# EAGLE schematic main_xml (EAGLE 7.7.0)

## Sheet 1 of 4
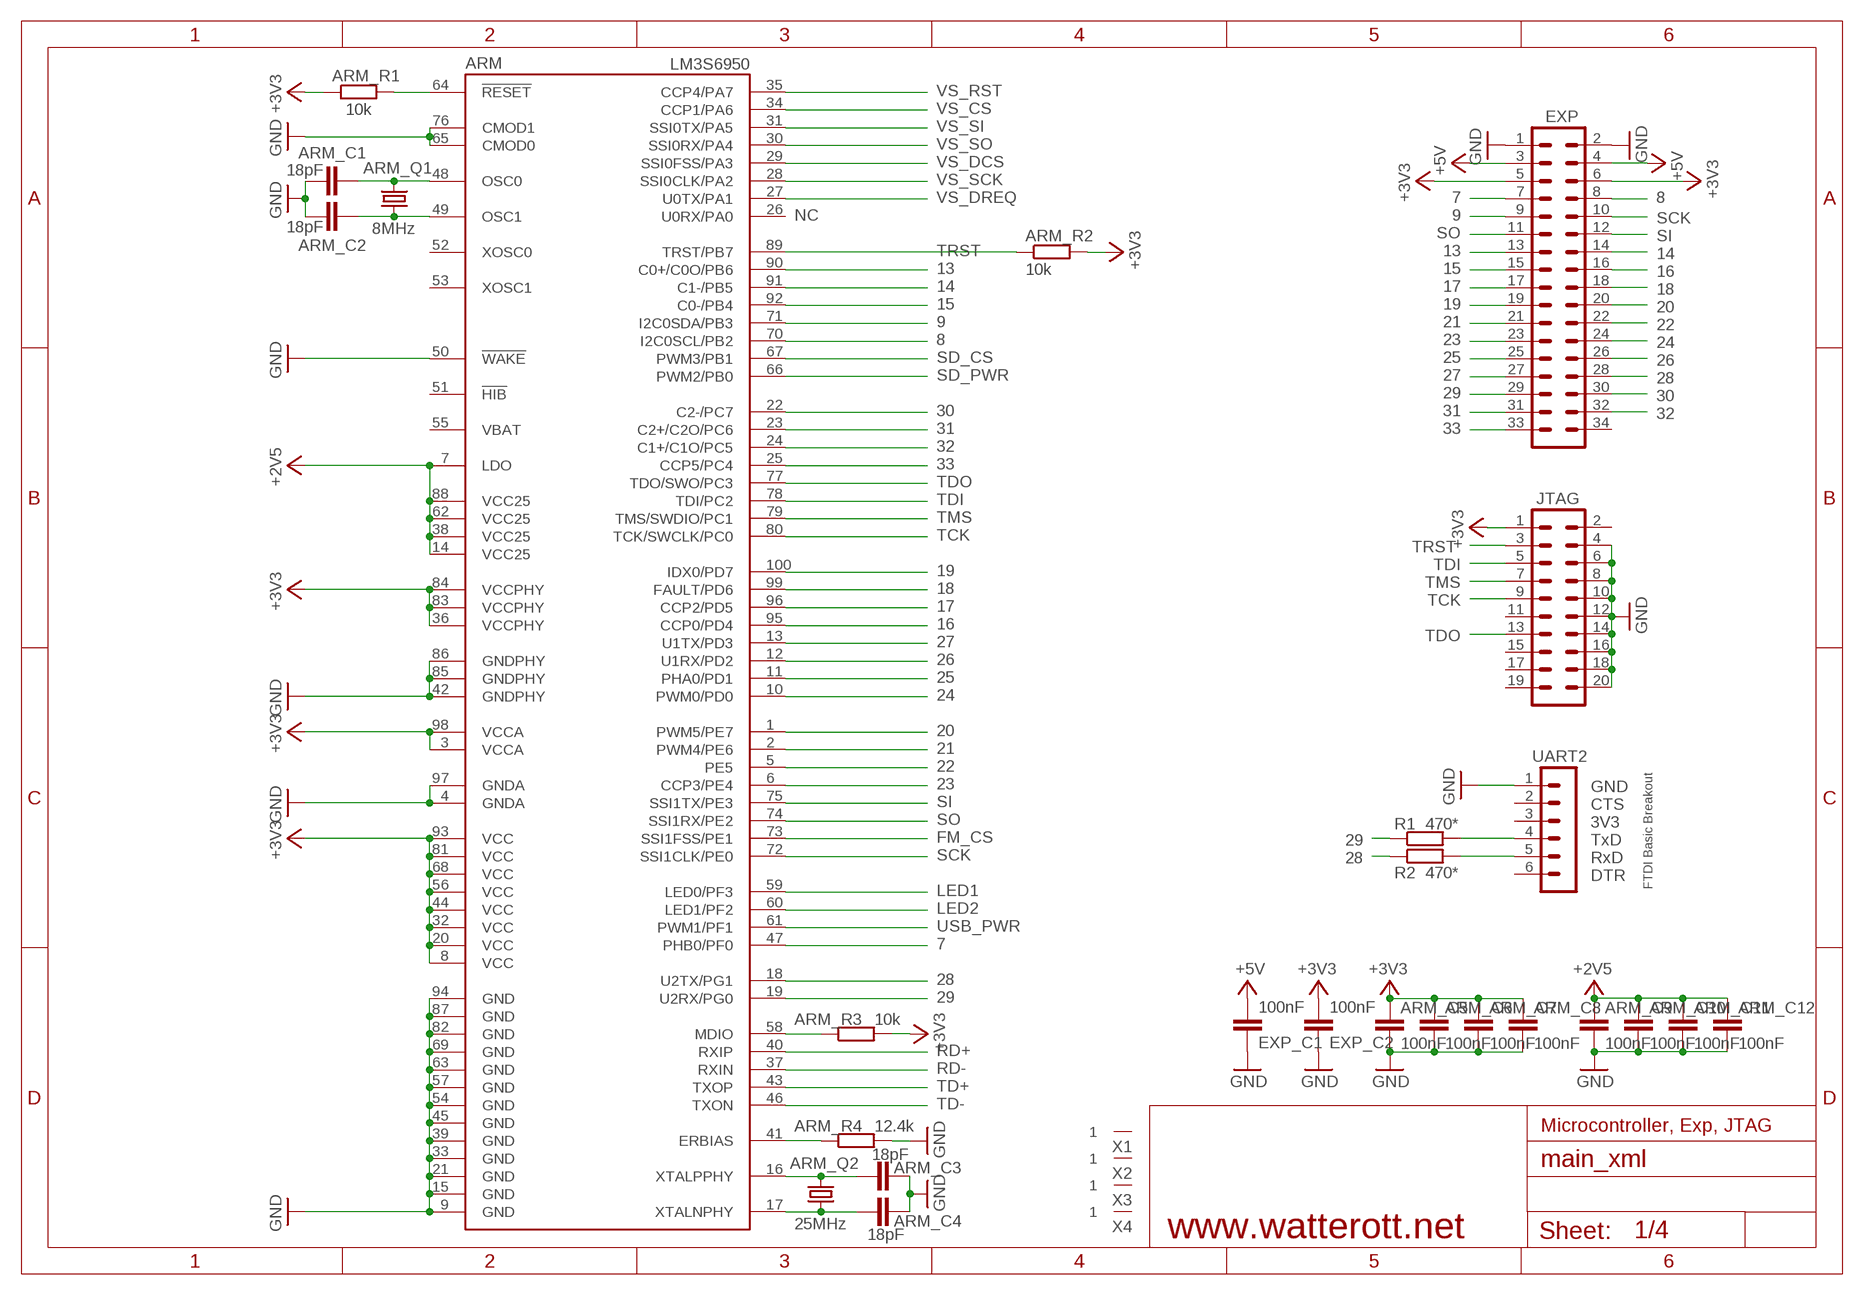
[diagram p0: schematic, sheet 1]

### Parts
ARM  LM3S6950  [LQFP100]
ARM_C1  18pF  C-EUC0603  [C0603]
ARM_C2  18pF  C-EUC0603  [C0603]
ARM_C3  18pF  C-EUC0603  [C0603]
ARM_C4  18pF  C-EUC0603  [C0603]
ARM_C5  100nF  C-EUC0603  [C0603]
ARM_C6  100nF  C-EUC0603  [C0603]
ARM_C7  100nF  C-EUC0603  [C0603]
ARM_C8  100nF  C-EUC0603  [C0603]
ARM_C9  100nF  C-EUC0603  [C0603]
ARM_C10  100nF  C-EUC0603  [C0603]
ARM_C11  100nF  C-EUC0603  [C0603]
ARM_C12  100nF  C-EUC0603  [C0603]
ARM_Q1  8MHz  CRYSTALCS10  [CS10]
ARM_Q2  25MHz  CRYSTALCS10  [CS10]
ARM_R1  10k  R-EU_R0603  [R0603]
ARM_R2  10k  R-EU_R0603  [R0603]
ARM_R3  10k  R-EU_R0603  [R0603]
ARM_R4  12.4k  R-EU_R0603  [R0603]
EXP  MA17-2  [MA17-2]
EXP_C1  100nF  C-EUC0603  [C0603]
EXP_C2  100nF  C-EUC0603  [C0603]
JTAG  MA10-2SMD  [MA10-2_SMD]
R1  470*  R-EU_R0603  [R0603]
R2  470*  R-EU_R0603  [R0603]
UART2  MA06-1  [MA06-1]
X1  ELLIPTICAL-PADS  [SMD-ELLIPSE]
X2  ELLIPTICAL-PADS  [SMD-ELLIPSE]
X3  ELLIPTICAL-PADS  [SMD-ELLIPSE]
X4  ELLIPTICAL-PADS  [SMD-ELLIPSE]

### Nets
7: ARM.47(PHB0/PF0) EXP.7
8: ARM.70(I2C0SCL/PB2) EXP.8
9: ARM.71(I2C0SDA/PB3) EXP.9
13: ARM.90(C0+/C0O/PB6) EXP.13
14: ARM.91(C1-/PB5) EXP.14
15: ARM.92(C0-/PB4) EXP.15
16: ARM.95(CCP0/PD4) EXP.16
17: ARM.96(CCP2/PD5) EXP.17
18: ARM.99(FAULT/PD6) EXP.18
19: ARM.100(IDX0/PD7) EXP.19
20: ARM.1(PWM5/PE7) EXP.20
21: ARM.2(PWM4/PE6) EXP.21
22: ARM.5(PE5) EXP.22
23: ARM.6(CCP3/PE4) EXP.23
24: ARM.10(PWM0/PD0) EXP.24
25: ARM.11(PHA0/PD1) EXP.25
26: ARM.12(U1RX/PD2) EXP.26
27: ARM.13(U1TX/PD3) EXP.27
28: ARM.18(U2TX/PG1) EXP.28 R2.1
29: ARM.19(U2RX/PG0) EXP.29 R1.1
30: ARM.22(C2-/PC7) EXP.30
31: ARM.23(C2+/C2O/PC6) EXP.31
32: ARM.24(C1+/C1O/PC5) EXP.32
33: ARM.25(CCP5/PC4) EXP.33
+2V5: ARM.7(LDO) ARM.14(VCC25) ARM.38(VCC25) ARM.62(VCC25) ARM.88(VCC25) ARM_C9.1 ARM_C10.1 ARM_C11.1 ARM_C12.1
+3V3: ARM.3(VCCA) ARM.8(VCC) ARM.20(VCC) ARM.32(VCC) ARM.36(VCCPHY) ARM.44(VCC) ARM.56(VCC) ARM.68(VCC) ARM.81(VCC) ARM.83(VCCPHY) ARM.84(VCCPHY) ARM.93(VCC) ARM.98(VCCA) ARM_C5.1 ARM_C6.1 ARM_C7.1 ARM_C8.1 ARM_R1.1 ARM_R2.2 ARM_R3.2 EXP.5 EXP.6 EXP_C2.2 JTAG.1 ; also sheet 2,3,4
+5V: EXP.3 EXP.4 EXP_C1.2 ; also sheet 3,4
ERBIAS: ARM.41(ERBIAS) ARM_R4.1
FM_CS: ARM.73(SSI1FSS/PE1) ; also sheet 2
GND: ARM.4(GNDA) ARM.9(GND) ARM.15(GND) ARM.21(GND) ARM.33(GND) ARM.39(GND) ARM.42(GNDPHY) ARM.45(GND) ARM.50(!WAKE) ARM.54(GND) ARM.57(GND) ARM.63(GND) ARM.65(CMOD0) ARM.69(GND) ARM.76(CMOD1) ARM.82(GND) ARM.85(GNDPHY) ARM.86(GNDPHY) ARM.87(GND) ARM.94(GND) ARM.97(GNDA) ARM_C1.2 ARM_C2.2 ARM_C3.2 ARM_C4.2 ARM_C5.2 ARM_C6.2 ARM_C7.2 ARM_C8.2 ARM_C9.2 ARM_C10.2 ARM_C11.2 ARM_C12.2 ARM_R4.2 EXP.1 EXP.2 EXP_C1.1 EXP_C2.1 JTAG.4 JTAG.6 JTAG.8 JTAG.10 JTAG.12 JTAG.14 JTAG.16 JTAG.18 JTAG.20 UART2.1 ; also sheet 2,3,4
LED1: ARM.59(LED0/PF3) ; also sheet 2
LED2: ARM.60(LED1/PF2) ; also sheet 2
MDIO: ARM.58(MDIO) ARM_R3.1
N$9: ARM.48(OSC0) ARM_C1.1 ARM_Q1.2
N$10: ARM.49(OSC1) ARM_C2.1 ARM_Q1.1
N$13: ARM.17(XTALNPHY) ARM_C4.1 ARM_Q2.1
N$14: ARM.16(XTALPPHY) ARM_C3.1 ARM_Q2.2
RD+: ARM.40(RXIP) ; also sheet 2
RD-: ARM.37(RXIN) ; also sheet 2
RESET: ARM.64(!RESET) ARM_R1.2
RXD: R2.2 UART2.5
SCK: ARM.72(SSI1CLK/PE0) EXP.10 ; also sheet 2
SD_CS: ARM.67(PWM3/PB1) ; also sheet 2
SD_PWR: ARM.66(PWM2/PB0) ; also sheet 2
SI: ARM.75(SSI1TX/PE3) EXP.12 ; also sheet 2
SO: ARM.74(SSI1RX/PE2) EXP.11 ; also sheet 2
TCK: ARM.80(TCK/SWCLK/PC0) JTAG.9
TD+: ARM.43(TXOP) ; also sheet 2
TD-: ARM.46(TXON) ; also sheet 2
TDI: ARM.78(TDI/PC2) JTAG.5
TDO: ARM.77(TDO/SWO/PC3) JTAG.13
TMS: ARM.79(TMS/SWDIO/PC1) JTAG.7
TRST: ARM.89(TRST/PB7) ARM_R2.1 JTAG.3
TXD: R1.2 UART2.4
USB_PWR: ARM.61(PWM1/PF1) ; also sheet 4
VS_CS: ARM.34(CCP1/PA6) ; also sheet 3
VS_DCS: ARM.29(SSI0FSS/PA3) ; also sheet 3
VS_DREQ: ARM.27(U0TX/PA1) ; also sheet 3
VS_RST: ARM.35(CCP4/PA7) ; also sheet 3
VS_SCK: ARM.28(SSI0CLK/PA2) ; also sheet 3
VS_SI: ARM.31(SSI0TX/PA5) ; also sheet 3
VS_SO: ARM.30(SSI0RX/PA4) ; also sheet 3
Unconnected: ARM.26(U0RX/PA0) ARM.51(!HIB) ARM.52(XOSC0) ARM.53(XOSC1) EXP.34 JTAG.2 JTAG.11 JTAG.15 JTAG.17 JTAG.19 UART2.2 UART2.3 UART2.6 X1.1 X2.1 X3.1 X4.1

### Notes on the sheet
- NC
- GND
- CTS
- 3V3
- TxD
- RxD
- DTR
- FTDI Basic Breakout
- Microcontroller, Exp, JTAG
- www.watterott.net

## Sheet 2 of 4
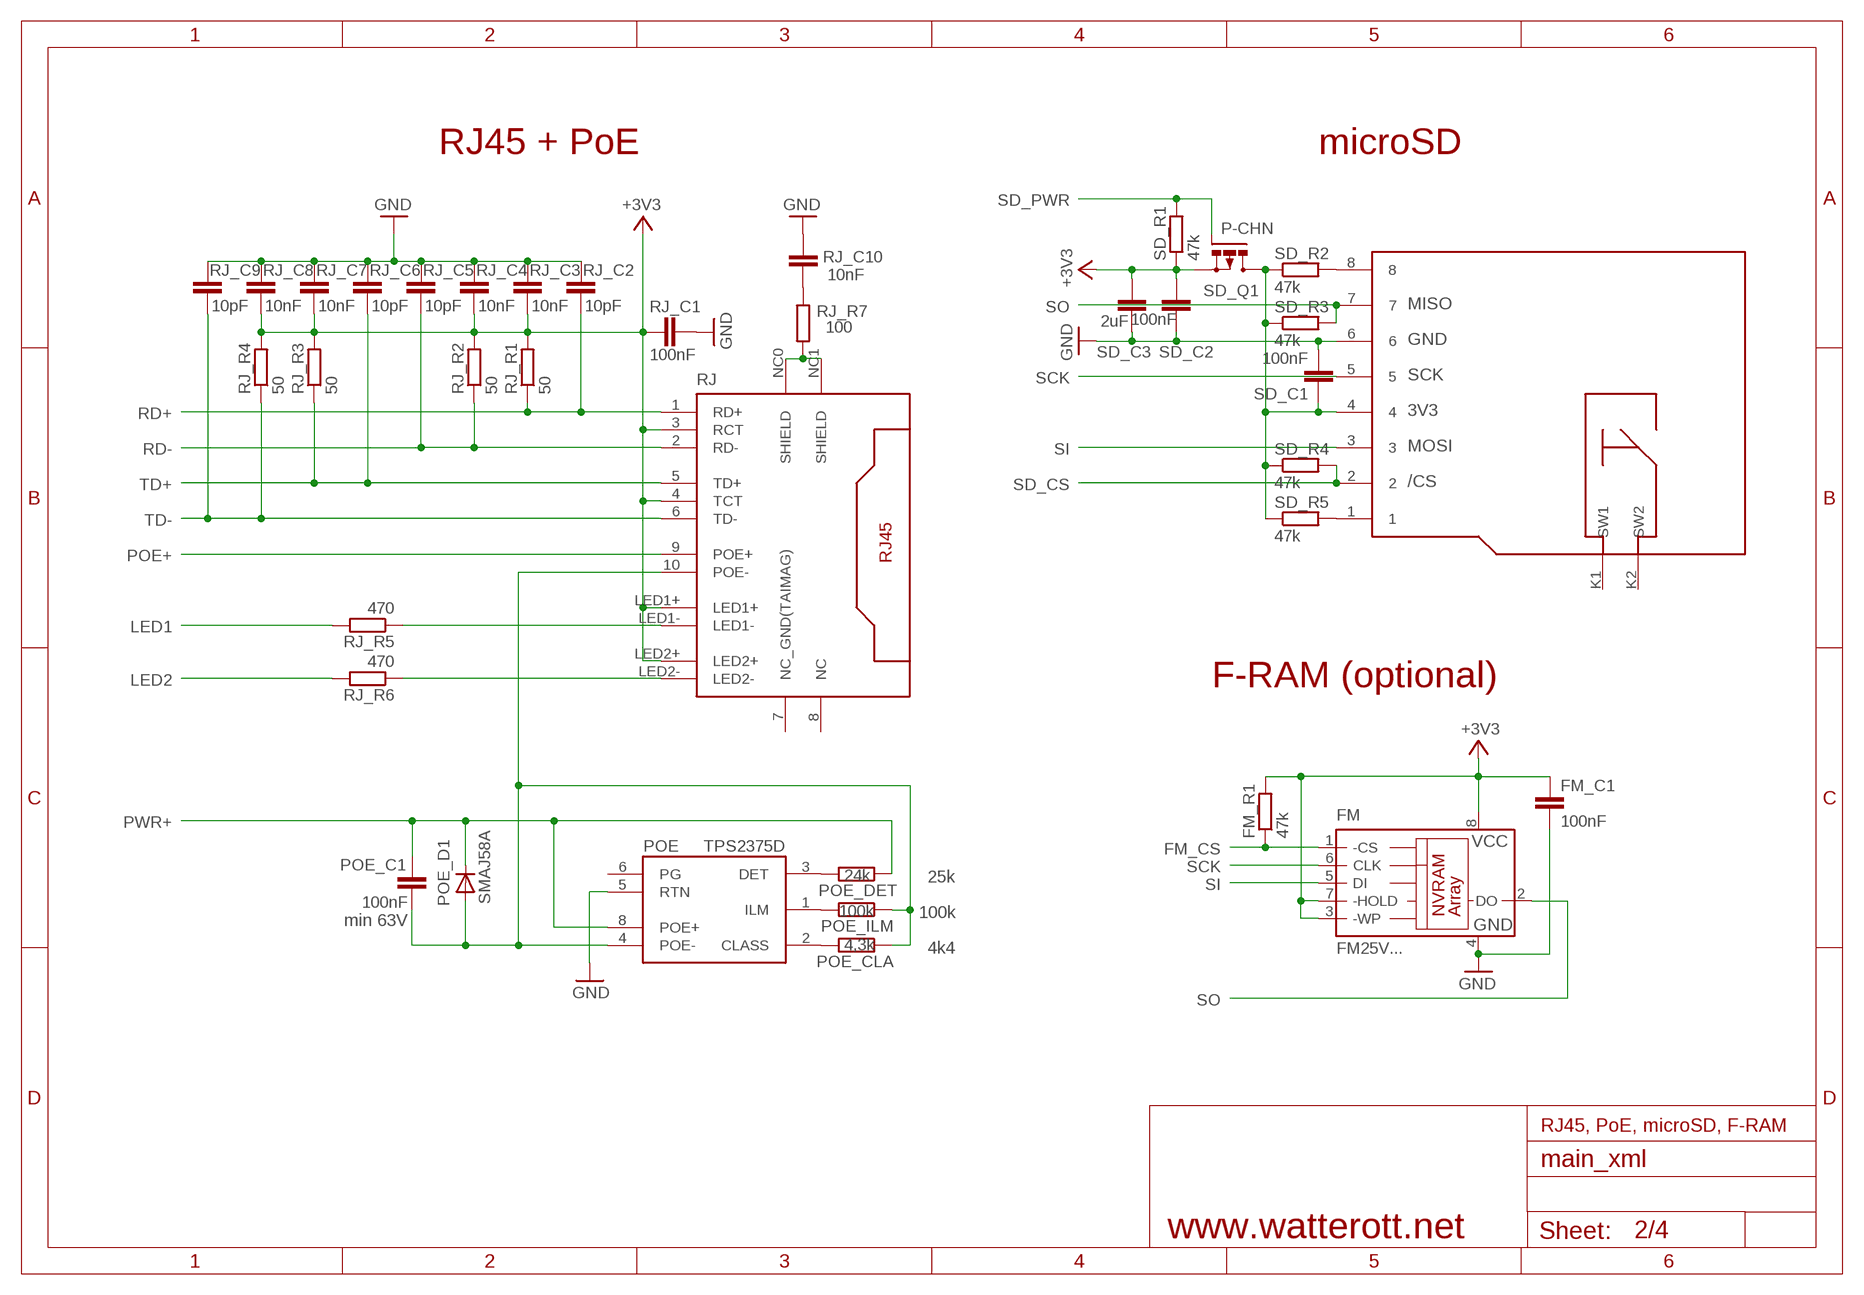
[diagram p1: schematic, sheet 2]

### Parts
FM  FM25V...  FM25-S  [SO8]
FM_C1  100nF  C-EUC0603  [C0603]
FM_R1  47k  R-EU_R0603  [R0603]
POE  TPS2375D  TPS237X  [SO08]
POE_C1  100nF  C-EUC1206  [C1206]
POE_CLA  4,3k  R-EU_R0603  [R0603]
POE_D1  SMAJ58A  DIODE-DO214AA  [DO214AA]
POE_DET  24k  R-EU_R0603  [R0603]
POE_ILM  100k  R-EU_R0603  [R0603]
RJ  RJ45-8-POEWE  [WE_POE]
RJ_C1  100nF  C-EUC0603  [C0603]
RJ_C2  10pF  C-EUC0603  [C0603]
RJ_C3  10nF  C-EUC0603  [C0603]
RJ_C4  10nF  C-EUC0603  [C0603]
RJ_C5  10pF  C-EUC0603  [C0603]
RJ_C6  10pF  C-EUC0603  [C0603]
RJ_C7  10nF  C-EUC0603  [C0603]
RJ_C8  10nF  C-EUC0603  [C0603]
RJ_C9  10pF  C-EUC0603  [C0603]
RJ_C10  10nF  C-EUC0603  [C0603]
RJ_R1  50  R-EU_R0603  [R0603]
RJ_R2  50  R-EU_R0603  [R0603]
RJ_R3  50  R-EU_R0603  [R0603]
RJ_R4  50  R-EU_R0603  [R0603]
RJ_R5  470  R-EU_R0603  [R0603]
RJ_R6  470  R-EU_R0603  [R0603]
RJ_R7  100  R-EU_R0603  [R0603]
SD  MICRO-SD  [MICRO-SD]
SD_C1  100nF  C-EUC0603  [C0603]
SD_C2  100nF  C-EUC0603  [C0603]
SD_C3  2uF  C-EUC0603  [C0603]
SD_Q1  P-CHN  IRLML6402  [MICRO3]
SD_R1  47k  R-EU_R0603  [R0603]
SD_R2  47k  R-EU_R0603  [R0603]
SD_R3  47k  R-EU_R0603  [R0603]
SD_R4  47k  R-EU_R0603  [R0603]
SD_R5  47k  R-EU_R0603  [R0603]

### Nets
+3V3: FM.3(-WP) FM.7(-HOLD) FM.8(VCC) FM_C1.1 FM_R1.2 RJ.3(RCT) RJ.4(TCT) RJ.LED1+ RJ.LED2+ RJ_C1.1 RJ_C3.2 RJ_C4.2 RJ_C7.2 RJ_C8.2 RJ_R1.2 RJ_R2.2 RJ_R3.2 RJ_R4.2 SD_C2.2 SD_C3.2 SD_Q1.2(S) SD_R1.1 ; also sheet 1,3,4
CLASS: POE.2(CLASS) POE_CLA.2
DET: POE.3(DET) POE_DET.2
FM_CS: FM.1(-CS) FM_R1.1 ; also sheet 1
GND: FM.4(GND) FM_C1.2 POE.5(RTN) RJ_C1.2 RJ_C2.1 RJ_C3.1 RJ_C4.1 RJ_C5.1 RJ_C6.1 RJ_C7.1 RJ_C8.1 RJ_C9.1 RJ_C10.2 SD.6 SD_C1.2 SD_C2.1 SD_C3.1 ; also sheet 1,3,4
ILM: POE.1(ILM) POE_ILM.2
LED1: RJ_R5.2 ; also sheet 1
LED2: RJ_R6.2 ; also sheet 1
N$4: RJ.LED2- RJ_R6.1
N$5: RJ.LED1- RJ_R5.1
N$29: RJ_C10.1 RJ_R7.1
POE+: RJ.9(POE+) ; also sheet 4
POE-: POE.4(POE-) POE_C1.2 POE_CLA.1 POE_D1.A POE_ILM.1 RJ.10(POE-)
PWR+: POE.8(POE+) POE_C1.1 POE_D1.C POE_DET.1 ; also sheet 4
RD+: RJ.1(RD+) RJ_C2.2 RJ_R1.1 ; also sheet 1
RD-: RJ.2(RD-) RJ_C5.2 RJ_R2.1 ; also sheet 1
SCK: FM.6(CLK) SD.5 ; also sheet 1
SD_1: SD.1 SD_R5.2
SD_3V3: SD.4 SD_C1.1 SD_Q1.3(D) SD_R2.1 SD_R3.1 SD_R4.1 SD_R5.1
SD_8: SD.8 SD_R2.2
SD_CS: SD.2 SD_R4.2 ; also sheet 1
SD_PWR: SD_Q1.1(G) SD_R1.2 ; also sheet 1
SHIELD: RJ.NC0(SHIELD) RJ.NC1(SHIELD) RJ_R7.2
SI: FM.5(DI) SD.3 ; also sheet 1
SO: FM.2(DO) SD.7 SD_R3.2 ; also sheet 1
TD+: RJ.5(TD+) RJ_C6.2 RJ_R3.1 ; also sheet 1
TD-: RJ.6(TD-) RJ_C9.2 RJ_R4.1 ; also sheet 1
Unconnected: POE.6(PG) SD.K1(SW1) SD.K2(SW2)

### Notes on the sheet
- RJ45 + PoE | microSD
- F-RAM (optional)
- 25k
- 100k
- 4k4
- RJ45, PoE, microSD, F-RAM
- www.watterott.net

## Sheet 3 of 4
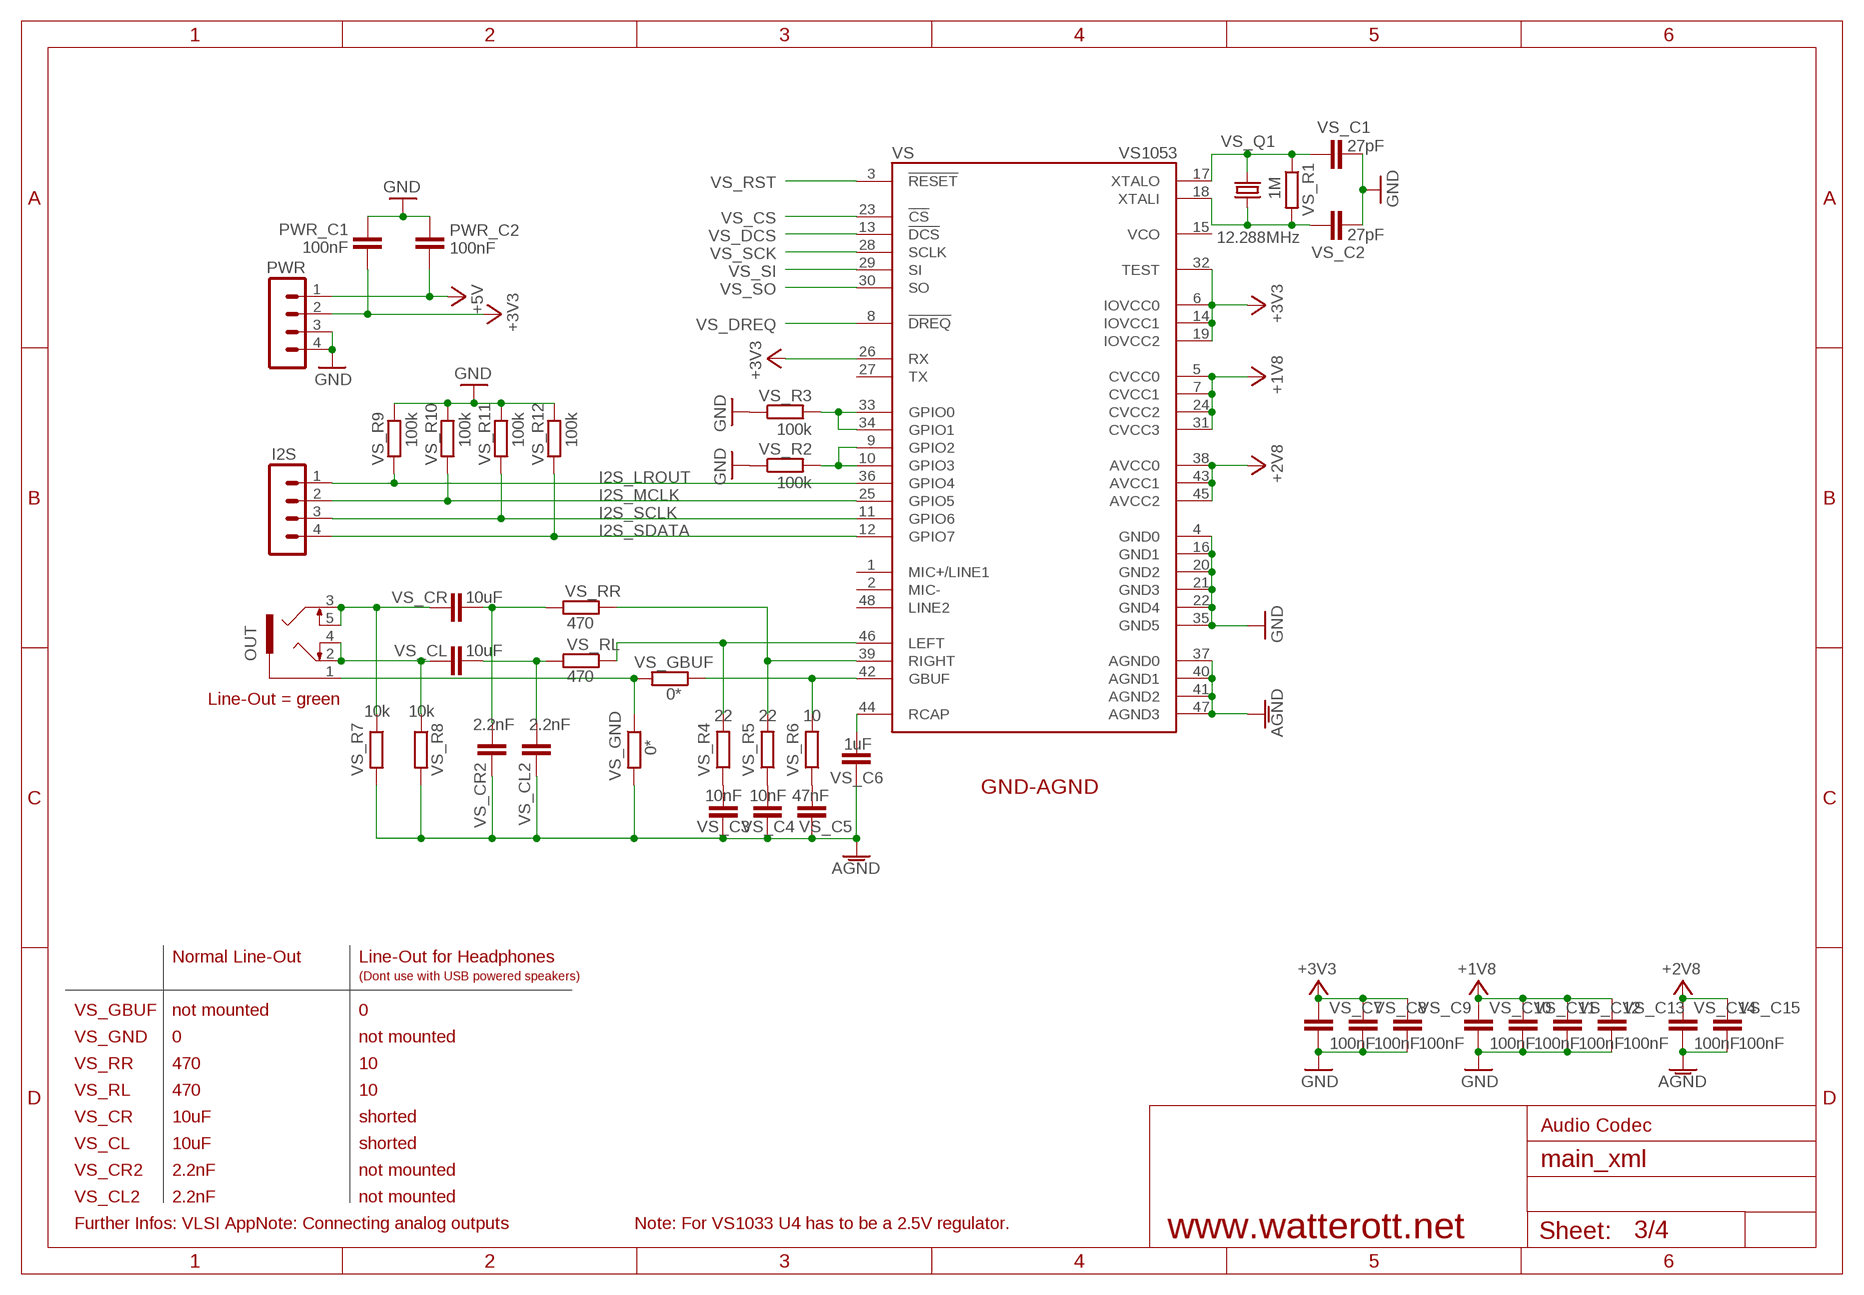
[diagram p2: schematic, sheet 3]

### Parts
I2S  MA04-1  [MA04-1]
OUT  1503_09  [1503_09]
PWR  MA04-1  [MA04-1]
PWR_C1  100nF  C-EUC0603  [C0603]
PWR_C2  100nF  C-EUC0603  [C0603]
VS  VS1053  [LQFP-48]
VS_C1  27pF  C-EUC0603  [C0603]
VS_C2  27pF  C-EUC0603  [C0603]
VS_C3  10nF  C-EUC0603  [C0603]
VS_C4  10nF  C-EUC0603  [C0603]
VS_C5  47nF  C-EUC0603  [C0603]
VS_C6  1uF  C-EUC0603  [C0603]
VS_C7  100nF  C-EUC0603  [C0603]
VS_C8  100nF  C-EUC0603  [C0603]
VS_C9  100nF  C-EUC0603  [C0603]
VS_C10  100nF  C-EUC0603  [C0603]
VS_C11  100nF  C-EUC0603  [C0603]
VS_C12  100nF  C-EUC0603  [C0603]
VS_C13  100nF  C-EUC0603  [C0603]
VS_C14  100nF  C-EUC0603  [C0603]
VS_C15  100nF  C-EUC0603  [C0603]
VS_CL  10uF  C-EUC1210  [C1210]
VS_CL2  2.2nF  C-EUC0603  [C0603]
VS_CR  10uF  C-EUC1210  [C1210]
VS_CR2  2.2nF  C-EUC0603  [C0603]
VS_GBUF  0*  R-EU_R0603  [R0603]
VS_GND  0*  R-EU_R0603  [R0603]
VS_Q1  12.288MHz  CRYSTALSM49  [SM49]
VS_R1  1M  R-EU_R0603  [R0603]
VS_R2  100k  R-EU_R0603  [R0603]
VS_R3  100k  R-EU_R0603  [R0603]
VS_R4  22  R-EU_R0603  [R0603]
VS_R5  22  R-EU_R0603  [R0603]
VS_R6  10  R-EU_R0603  [R0603]
VS_R7  10k  R-EU_R0603  [R0603]
VS_R8  10k  R-EU_R0603  [R0603]
VS_R9  100k  R-EU_R0603  [R0603]
VS_R10  100k  R-EU_R0603  [R0603]
VS_R11  100k  R-EU_R0603  [R0603]
VS_R12  100k  R-EU_R0603  [R0603]
VS_RL  470  R-EU_R0603  [R0603]
VS_RR  470  R-EU_R0603  [R0603]

### Nets
+1V8: VS.5(CVCC0) VS.7(CVCC1) VS.24(CVCC2) VS.31(CVCC3) VS_C10.1 VS_C11.1 VS_C12.1 VS_C13.1 ; also sheet 4
+2V8: VS.38(AVCC0) VS.43(AVCC1) VS.45(AVCC2) VS_C14.1 VS_C15.1 ; also sheet 4
+3V3: PWR.2 PWR_C1.2 VS.6(IOVCC0) VS.14(IOVCC1) VS.19(IOVCC2) VS.26(RX) VS.32(TEST) VS_C7.1 VS_C8.1 VS_C9.1 ; also sheet 1,2,4
+5V: PWR.1 PWR_C2.2 ; also sheet 1,4
AGND: VS.37(AGND0) VS.40(AGND1) VS.41(AGND2) VS.47(AGND3) VS_C3.1 VS_C4.1 VS_C5.1 VS_C6.1 VS_C14.2 VS_C15.2 VS_CL2.2 VS_CR2.2 VS_GND.2 VS_R7.2 VS_R8.2 ; also sheet 4
GBUF: VS.42(GBUF) VS_GBUF.1 VS_R6.2
GND: PWR.3 PWR.4 PWR_C1.1 PWR_C2.1 VS.4(GND0) VS.16(GND1) VS.20(GND2) VS.21(GND3) VS.22(GND4) VS.35(GND5) VS_C1.2 VS_C2.2 VS_C7.2 VS_C8.2 VS_C9.2 VS_C10.2 VS_C11.2 VS_C12.2 VS_C13.2 VS_R2.1 VS_R3.1 VS_R9.2 VS_R10.2 VS_R11.2 VS_R12.2 ; also sheet 1,2,4
I2S_LROUT: I2S.1 VS.36(GPIO4) VS_R9.1
I2S_MCLK: I2S.2 VS.25(GPIO5) VS_R10.1
I2S_SCLK: I2S.3 VS.11(GPIO6) VS_R11.1
I2S_SDATA: I2S.4 VS.12(GPIO7) VS_R12.1
LEFT: VS.46(LEFT) VS_R4.2 VS_RL.1
N$3: VS.33(GPIO0) VS.34(GPIO1) VS_R3.2
N$6: VS.9(GPIO2) VS.10(GPIO3) VS_R2.2
N$8: VS.18(XTALI) VS_C2.1 VS_Q1.1 VS_R1.2
N$11: VS.17(XTALO) VS_C1.1 VS_Q1.2 VS_R1.1
N$18: OUT.1 VS_GBUF.2 VS_GND.1
N$19: OUT.3 OUT.5 VS_CR.2 VS_R7.1
N$20: OUT.2 OUT.4 VS_CL.2 VS_R8.1
N$21: VS_CR2.1 VS_CR.1 VS_RR.2
N$22: VS_CL2.1 VS_CL.1 VS_RL.2
N$31: VS_C3.2 VS_R4.1
N$32: VS_C4.2 VS_R5.1
N$33: VS_C5.2 VS_R6.1
RCAP: VS.44(RCAP) VS_C6.2
RIGHT: VS.39(RIGHT) VS_R5.2 VS_RR.1
VS_CS: VS.23(!CS) ; also sheet 1
VS_DCS: VS.13(!DCS) ; also sheet 1
VS_DREQ: VS.8(!DREQ) ; also sheet 1
VS_RST: VS.3(!RESET) ; also sheet 1
VS_SCK: VS.28(SCLK) ; also sheet 1
VS_SI: VS.29(SI) ; also sheet 1
VS_SO: VS.30(SO) ; also sheet 1
Unconnected: VS.1(MIC+/LINE1) VS.2(MIC-) VS.15(VCO) VS.27(TX) VS.48(LINE2)

### Notes on the sheet
- Line-Out = green
- GND-AGND
- Normal Line-Out | Line-Out for Headphones
- (Dont use with USB powered speakers)
- VS_GBUF | not mounted | 0
- VS_GND | 0 | not mounted
- VS_RR | 470 | 10
- VS_RL | 470 | 10
- VS_CR | 10uF | shorted
- Audio Codec
- VS_CL | 10uF | shorted
- VS_CR2 | 2.2nF | not mounted
- VS_CL2 | 2.2nF | not mounted
- Further Infos: VLSI AppNote: Connecting analog outputs | Note: For VS1033 U4 has to be a 2.5V regulator.
- www.watterott.net

## Sheet 4 of 4
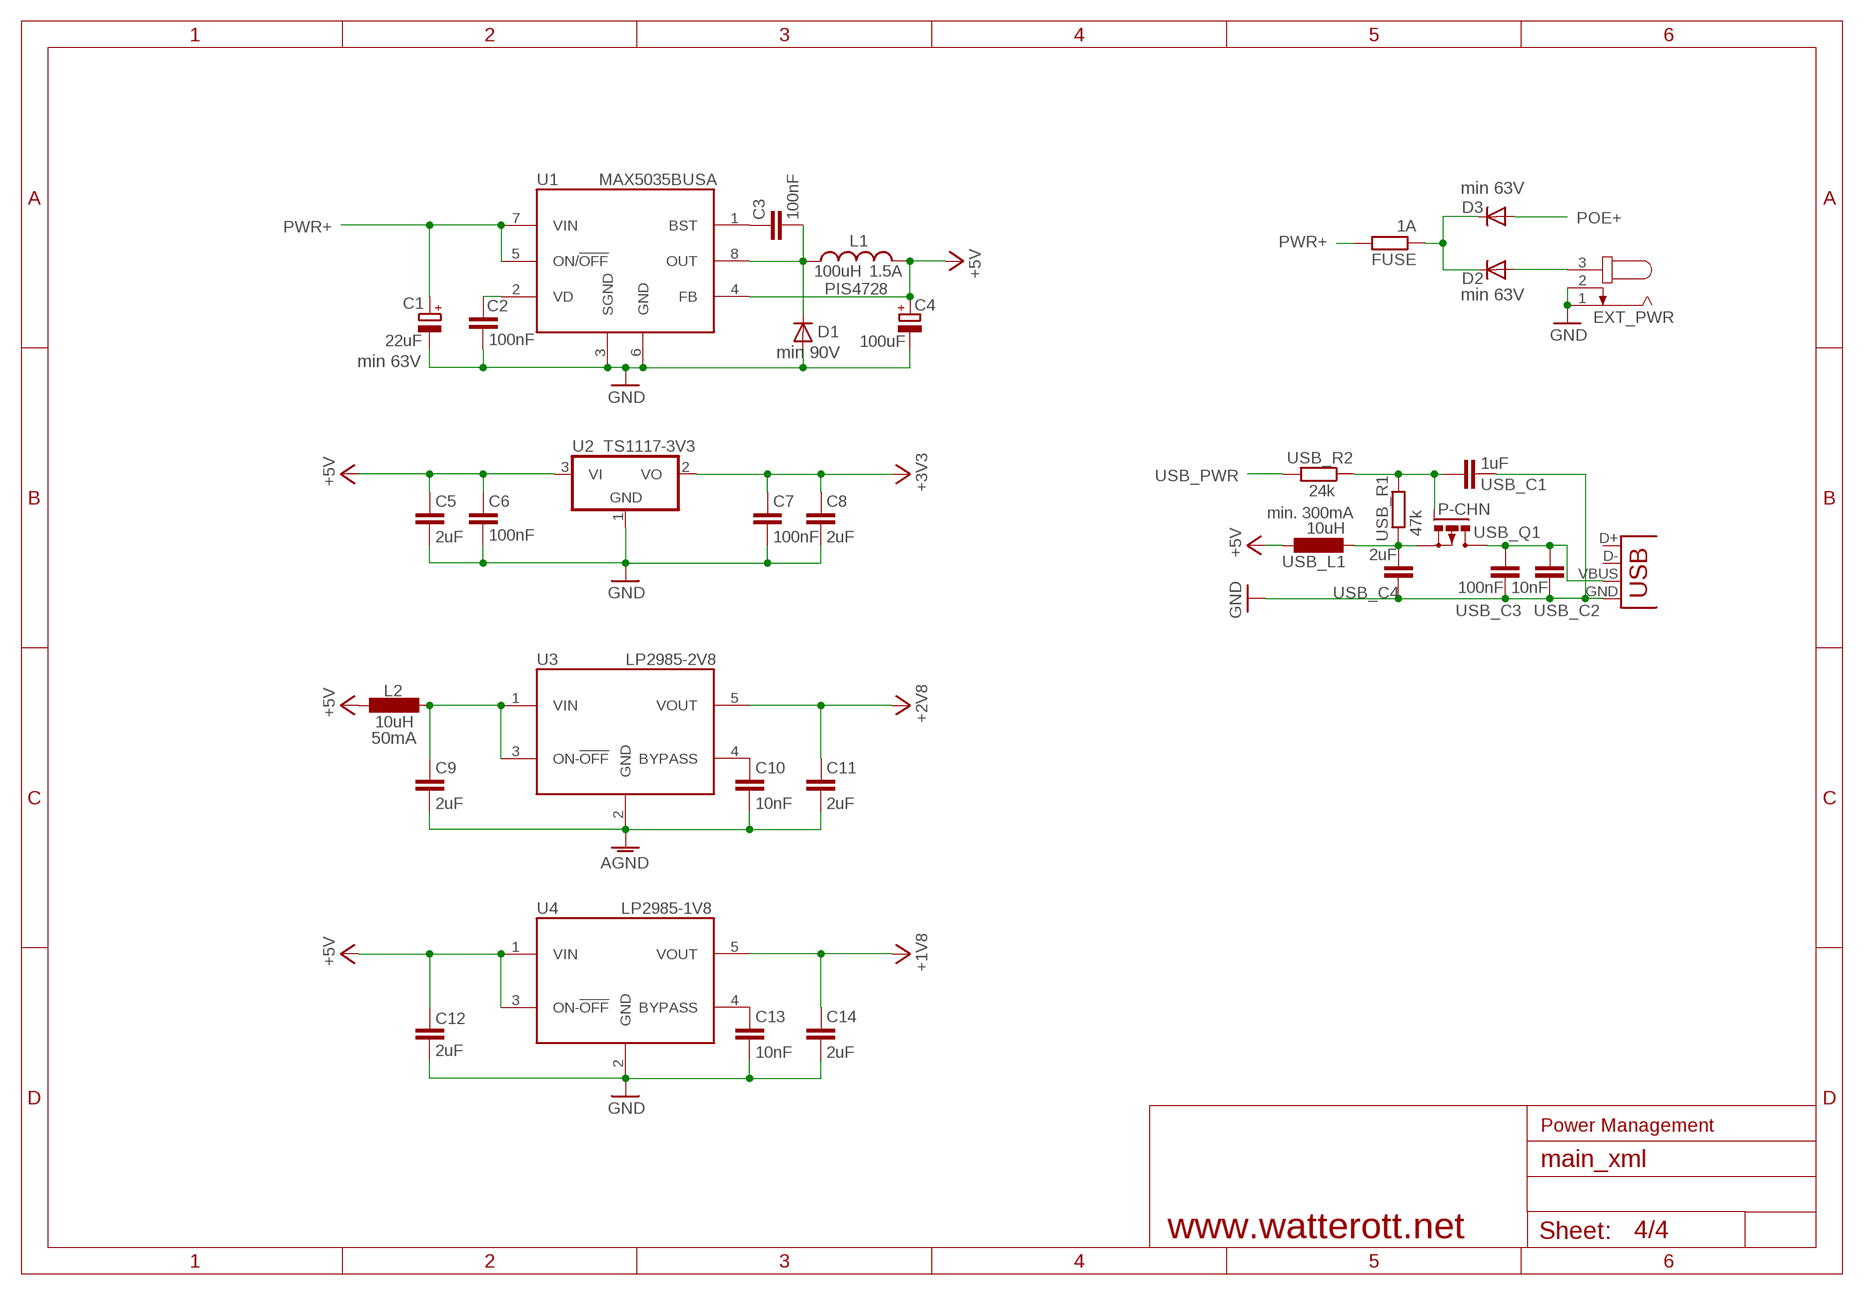
[diagram p3: schematic, sheet 4]

### Parts
C1  22uF  CPOL-EU153CLV-0810  [153CLV-0810]
C2  100nF  C-EUC0603  [C0603]
C3  100nF  C-EUC0603  [C0603]
C4  100uF  CPOL-EU153CLV-0810  [153CLV-0810]
C5  2uF  C-EUC0603  [C0603]
C6  100nF  C-EUC0603  [C0603]
C7  100nF  C-EUC0603  [C0603]
C8  2uF  C-EUC0603  [C0603]
C9  2uF  C-EUC0603  [C0603]
C10  10nF  C-EUC0603  [C0603]
C11  2uF  C-EUC0603  [C0603]
C12  2uF  C-EUC0603  [C0603]
C13  10nF  C-EUC0603  [C0603]
C14  2uF  C-EUC0603  [C0603]
D1  DIODE-DO214AA  [DO214AA]
D2  DIODE-DO214AA  [DO214AA]
D3  DIODE-DO214AA  [DO214AA]
EXT_PWR  JACK-PLUG0  [SPC4077]
FUSE  1A  R-EU_R1206  [R1206]
L1  100uH  INDUCTORCDRH  [CDRH]
L2  10uH  L-EUL3230M  [L3230M]
U1  MAX5035BUSA  MAX5035  [SO8]
U2  TS1117-3V3  TS1117  [SOT223]
U3  LP2985-2V8  LP2985  [SOT23-5]
U4  LP2985-1V8  LP2985  [SOT23-5]
USB  USB-A-S  [USB-A-S]
USB_C1  1uF  C-EUC0603  [C0603]
USB_C2  10nF  C-EUC0603  [C0603]
USB_C3  100nF  C-EUC0603  [C0603]
USB_C4  2uF  C-EUC0805  [C0805]
USB_L1  10uH  L-EUL3230M  [L3230M]
USB_Q1  P-CHN  IRLML6402  [MICRO3]
USB_R1  47k  R-EU_R0603  [R0603]
USB_R2  24k  R-EU_R0603  [R0603]

### Nets
5V_VIN: C9.2 L2.2 U3.1(VIN) U3.3(ON-!OFF)
+1V8: C14.1 U4.5(VOUT) ; also sheet 3
+2V8: C11.1 U3.5(VOUT) ; also sheet 3
+3V3: C7.1 C8.1 U2.2(VO) ; also sheet 1,2,3
+5V: C4.+ C5.1 C6.2 C12.2 L1.2 L2.1 U1.4(FB) U2.3(VI) U4.1(VIN) U4.3(ON-!OFF) USB_L1.1 ; also sheet 1,3
AGND: C9.1 C10.2 C11.2 U3.2(GND) ; also sheet 3
BST: C3.1 U1.1(BST)
GND: C1.- C2.2 C4.- C5.2 C6.1 C7.2 C8.2 C12.1 C13.2 C14.2 D1.A EXT_PWR.1 EXT_PWR.2 U1.3(SGND) U1.6(GND) U2.1(GND) U4.2(GND) USB.GND USB_C1.1 USB_C2.2 USB_C3.2 USB_C4.1 ; also sheet 1,2,3
N$2: USB_C4.2 USB_L1.2 USB_Q1.2(S) USB_R1.1
N$12: USB.VBUS USB_C2.1 USB_C3.1 USB_Q1.3(D)
N$16: USB_C1.2 USB_Q1.1(G) USB_R1.2 USB_R2.1
N$23: D2.A EXT_PWR.3
N$24: D2.C D3.C FUSE.1
N$27: C10.1 U3.4(BYPASS)
N$28: C13.1 U4.4(BYPASS)
OUT: C3.2 D1.C L1.1 U1.8(OUT)
POE+: D3.A ; also sheet 2
PWR+: C1.+ FUSE.2 U1.5(ON/!OFF) U1.7(VIN) ; also sheet 2
USB_PWR: USB_R2.2 ; also sheet 1
VD: C2.1 U1.2(VD)
Unconnected: USB.D+ USB.D-

### Notes on the sheet
- 1.5A
- PIS4728
- Power Management
- www.watterott.net

## Power pins joined to a net without a drawn wire
NC: RJ.8(NC)
NC_GND(TAIMAG): RJ.7(NC_GND(TAIMAG))
VBAT: ARM.55(VBAT)

## Library data of the parts
ARM = Luminary:LM3S6950
ARM_C1-ARM_C12 C2 C3 C5-C14 EXP_C1 EXP_C2 FM_C1 PWR_C1 PWR_C2 RJ_C1-RJ_C10 SD_C1-SD_C3 USB_C1-USB_C4 VS_C1-VS_C15 VS_CL VS_CL2 VS_CR VS_CR2 = rcl:C-EU: CAPACITOR, European symbol
ARM_Q1 ARM_Q2 VS_Q1 = Crystal:CRYSTAL: CRYSTAL
ARM_R1-ARM_R4 FM_R1 FUSE POE_CLA POE_DET POE_ILM R1 R2 RJ_R1-RJ_R7 SD_R1-SD_R5 USB_R1 USB_R2 VS_GBUF VS_GND VS_R1-VS_R12 VS_RL VS_RR = rcl:R-EU_: RESISTOR, European symbol
C1 = rcl:CPOL-EU: POLARIZED CAPACITOR, European symbol; VOLTAGE: min 63V
C4 = rcl:CPOL-EU: POLARIZED CAPACITOR, European symbol
D1 = diode:DIODE-: DIODE; VOLTAGE: min 90V
D2 D3 = diode:DIODE-: DIODE; VOLTAGE: min 63V
EXP = con-lstb:MA17-2: PIN HEADER
EXT_PWR = con-jack:JACK-PLUG: DC POWER JACK Power Jack, DC, Right Angle, Through Hole, Rated 5A at 16VDC, PC Terminals Distributor: Farnell (www.Farnell.de) Drawing: 84N1161.pdf / 84N1162.pdf Manufacturer: SPC Technology (www.spctechnology.com) Type: SPC4077 / SPC 4078
FM = Ramtron:FM25*: SPI Serial NVRAM
I2S PWR = con-lstb:MA04-1: PIN HEADER
JTAG = Con-lst:MA10-2: PIN HEADER
L1 = Voltage-Reg:INDUCTOR
L2 = rcl:L-EU: INDUCTOR, European symbol; CURRENT: 50mA
OUT = Audio:1503_09: Jack connectors according to JISC 6560, 3.5 mm Klinkeneinbaukupplung nach JISC 6560, 3,5 mm, 3-polig/ stereo, abgewinkelte Ausführung, mit 2 Öffnern und Lötaugen, für Leiterplatten Rückseitenmontage Source: http://www.lumberg.com/Produkte/PDFs/1503_09.pdf
POE = ethernet:TPS237X
POE_C1 = rcl:C-EU: CAPACITOR, European symbol; VOLTAGE: min 63V
POE_D1 = diode:DIODE-: DIODE
RJ = ethernet:RJ45-8-POE: Würth Elektronik RJ45: WE-7499211121 Taimag RJ45: RJPLB-203TC1 Tyco RJ45: 6605822
SD = SD-Card:MICRO-SD
SD_Q1 USB_Q1 = IRF-sot23:IRLML6402: P-Channel Power MOSFET
U1 = Voltage-Reg:MAX5035
U2 = Voltage-Reg:TS1117
U3 U4 = Voltage-Reg:LP2985
UART2 = con-lstb:MA06-1: PIN HEADER
USB = con-usb:USB: USB Connectors
USB_L1 = rcl:L-EU: INDUCTOR, European symbol; CURRENT: min. 300mA
VS = VLSI:VS1053
X1-X4 = special-pad:ELLIPTICAL-PAD: Elliptical Pad